# Altium schematic sheet Power.SchDoc: Power
size A4; SheetNumber: 3; SheetTotal: 5
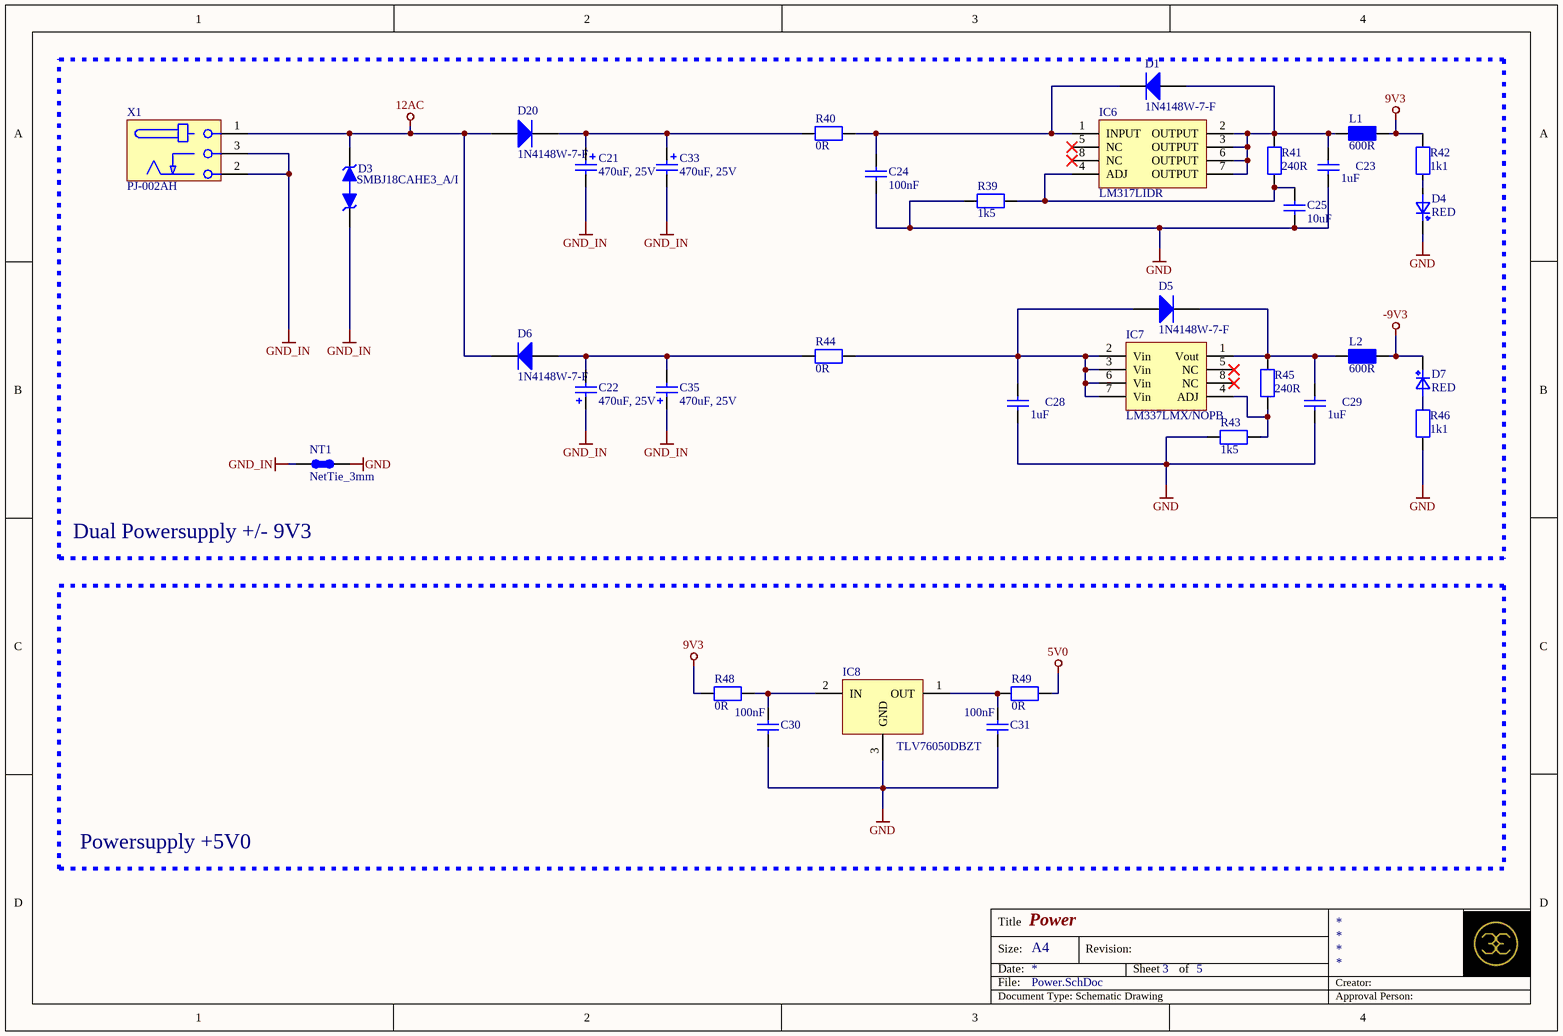
[diagram p0: Power.SchDoc]

## Parts
C21  470uF, 25V  [WCAP-ATG8_D8H11.5]
C22  470uF, 25V  [WCAP-ATG8_D8H11.5]
C23  1uF  [CAPC2012X145N]
C24  100nF  [CAPC1608X95N]
C25  10uF  [CAPC2012X145N]
C28  1uF  [CAPC2012X145N]
C29  1uF  [CAPC2012X145N]
C30  100nF  [CAPC1608X95N]
C31  100nF  [CAPC1608X95N]
C33  470uF, 25V  [WCAP-ATG8_D8H11.5]
C35  470uF, 25V  [WCAP-ATG8_D8H11.5]
D1  1N4148W-7-F  [SOD-123]
D3  SMBJ18CAHE3_A/I  [DIOM4336X24N]
D4  RED  [WL-SMCW_0805]
D5  1N4148W-7-F  [SOD-123]
D6  1N4148W-7-F  [SOD-123]
D7  RED  [WL-SMCW_0805]
D20  1N4148W-7-F  [SOD-123]
IC6  LM317LIDR  [SOIC127P600X175-8N]
IC7  LM337LMX/NOPB  [SOIC127P600X175-8N]
IC8  TLV76050DBZT  [SOT95P280X135-3N_123]
L1  600R  [INDC2012X85N]
L2  600R  [INDC2012X85N]
NT1  NetTie_3mm  [NET_TIE_3MM]  (net tie, no BOM)
R39  1k5  [RESC2012X70N]
R40  0R  [RESC2012X70N]
R41  240R  [RESC2012X70N]
R42  1k1  [RESC2012X70N]
R43  1k5  [RESC2012X70N]
R44  0R  [RESC2012X70N]
R45  240R  [RESC2012X70N]
R46  1k1  [RESC2012X70N]
R48  0R  [RESC2012X70N]
R49  0R  [RESC2012X70N]
X1  PJ-002AH  [PJ3L1400H110]

## Blocks framed on the sheet
Dual Powersupply +/- 9V3: C21-C25 C28 C29 C33 C35 D1 D3-D7 D20 IC6 IC7 L1 L2 NT1 R39-R46 X1
Powersupply +5V0: C30 C31 IC8 R48 R49

## Nets
5V0: R49.2
9V3: L1.2 R42.2 R48.1
12AC: D3.K D6.2(K) D20.1(A) X1.1
-9V3: D7.K L2.2
GND: C23.1 C24.1 C25.1 C28.1 C29.1 C30.1 C31.1 D4.K IC8.3(GND) NT1.1 R39.1 R43.1 R46.2
GND_IN: C21.N C22.P C33.N C35.P D3.A NT1.2 X1.2 X1.3
NetC21_P: C21.P C33.P D20.2(K) R40.1
NetC22_N: C22.N C35.N D6.1(A) R44.1
NetC23_2: C23.2 D1.1(A) IC6.2(OUTPUT) IC6.3(OUTPUT) IC6.6(OUTPUT) IC6.7(OUTPUT) L1.1 R41.2
NetC24_2: C24.2 D1.2(K) IC6.1(INPUT) R40.2
NetC25_2: C25.2 IC6.4(ADJ) R39.2 R41.1
NetC28_2: C28.2 D5.1(A) IC7.2(Vin) IC7.3(Vin) IC7.6(Vin) IC7.7(Vin) R44.2
NetC29_2: C29.2 D5.2(K) IC7.1(Vout) L2.1 R45.2
NetC30_2: C30.2 IC8.2(IN) R48.2
NetC31_2: C31.2 IC8.1(OUT) R49.1
NetD4_A: D4.A R42.1
NetD7_A: D7.A R46.1
NetIC7_4: IC7.4(ADJ) R43.2 R45.1

Not connected (* = marked no-connect by the designer): IC6 5(NC)* 8(NC)*; IC7 5(NC)* 8(NC)*

## Notes on the sheet
- Title
- Size:
- Date:
- File:
- A4
- Revision:
- Sheet
- of
- Creator:
- Document Type: Schematic Drawing
- Approval Person:

## Library data of the parts
C21 C22 C33 C35 = CAP_470uF, 25V: WCAP-ATG8 Aluminum Electrolytic Capacitor, Radial, THT, D8xH11.5, 470uF, 25V; Manufacturer: Wurth Elektronik; Manufacturer Part Number: 860010474013; Voltage Rating: 50V; Tolerance: 20%; Alternatives allowed: YES
C23 C28 C29 = CAP_1uF_0805: Multilayer Ceramic Capacitors MLCC - SMD/SMT, 1uF; Manufacturer: Samsung Electro-Mechanics; Manufacturer Part Number: CL21B105KBFNNNE; Voltage Rating: 50V; Tolerance: 10%; Alternatives allowed: yes; JLC: C28323
C24 C30 C31 = CAP_100nF_0603: Multilayer Ceramic Capacitors MLCC - SMD/SMT, 100nF; Manufacturer: YAGEO; Manufacturer Part Number: CC0603KRX7R9BB104; Voltage Rating: 50VDC; Tolerance: 10%; Alternatives allowed: yes; JLC: C14663
C25 = CAP_10uF_0805: Multilayer Ceramic Capacitors MLCC - SMD/SMT, 10uF; Manufacturer: Samsung Electro-Mechanics; Manufacturer Part Number: CL21A106KAYNNNE; Voltage Rating: 25V; Tolerance: 10%; Alternatives allowed: yes; JLC: C15850
D1 D5 D6 D20 = 1N4148W-7-F: Diodes - General Purpose, Power, Switching SURFACE MOUNT FAST SWITCHING DIODE 2A; Manufacturer: Diodes Incorporated; Package: SOD-123; Manufacturer Part Number: 1N4148W-7-F; JLC: C81598
D3 = DIO_SMBJ18CAHE3_A/I: ESD Suppressors / TVS Diodes 600W 18V 5% SMB (DO-214AA); Manufacturer: Vishay General Semiconductor; Alternatives allowed: YES; Manufacturer Part Number: SMBJ18CAHE3_A/I; Voltage Rating: 18V
D4 D7 = LED_0805_RED_AK: Standard LEDs - SMD WL-SMCW SMDMono TpVw Waterclr 0805 Red; Manufacturer: Wurth Elektronik; Manufacturer Part Number: 150080RS75000; Voltage Rating: 2.0; Alternatives allowed: YES; JLC: C84256
IC6 = IC_LM317LIDR: Linear Voltage Regulators; Manufacturer: Texas Instruments; Alternatives allowed: NO; Manufacturer Part Number: LM317LIDR; JLC: *
IC7 = IC_LM337LMX/NOPB: IC REG LIN POS ADJ 300MA SOT25; Manufacturer: Texas Instruments; Alternatives allowed: NO; Manufacturer Part Number: LM337LMX/NOPB; JLC: *
IC8 = IC_TLV76050DBZT: PMIC - Spannungsregler - Linear Positiv Fest 1 Ausgang 100mA SOT-23-3; Manufacturer: Texas Instruments; Alternatives allowed: NO; Manufacturer Part Number: TLV76050DBZT; JLC: *
L1 L2 = FB_600R_600mA_0805: Ferrite Beads 0805 600 OHM; Manufacturer: Murata Electronics; Manufacturer Part Number: BLM21AG601SN1D; Lumira Part Number: MS-1042; Tolerance: 25%; Alternatives allowed: YES; JLC: C1017
NT1 = NetTie_3mm: 3mm NetTie; Notes: PCB connection only
R39 R43 = RES_1k5_0805: Thick Film Resistors - SMD 1.5 kOhms 125 mW 0805 1% AEC-Q200; Manufacturer: YAGEO; Manufacturer Part Number: AC0805FR-071K5L; Voltage Rating: 150V; Alternatives allowed: YES; Tolerance: 1%; JLC: C4310
R40 R44 R48 R49 = RES_0R_0805: Thick Film Resistors - SMD 1/8watt ZEROohm Jumper; Manufacturer: Vishay; Manufacturer Part Number: CRCW08050000Z0EA; Voltage Rating: 150V; Tolerance: 1%; Alternatives allowed: YES; JLC: C17477
R41 R45 = RES_240R_0805: Thick Film Resistors - SMD 1/8watt 240ohms 1%; Manufacturer: Vishay / Dale; Manufacturer Part Number: CRCW0805240RFKEA; Voltage Rating: 150V; Alternatives allowed: YES; Tolerance: 1%; JLC: C17572
R42 R46 = RES_1k1_0805: Thick Film Resistors - SMD 1/8watt 1.1Kohms 1% 100ppm; Manufacturer: Vishay / Dale; Manufacturer Part Number: CRCW08051K10FKEA; Voltage Rating: 150V; Alternatives allowed: YES; Tolerance: 1%
X1 = PJ-002AH: DC Power Connectors Power Jacks, Inside Contact Diameter 2mm, Outside Contact Diameter 6,5mm; Manufacturer: CUI Devices; Lumira Part Number: S-QMS-SPEC-32532; Voltage Rating: 24V; Alternatives allowed: NO; Manufacturer Part Number: PJ-002AH